# EAGLE design untitled (EAGLE 8.6.0)
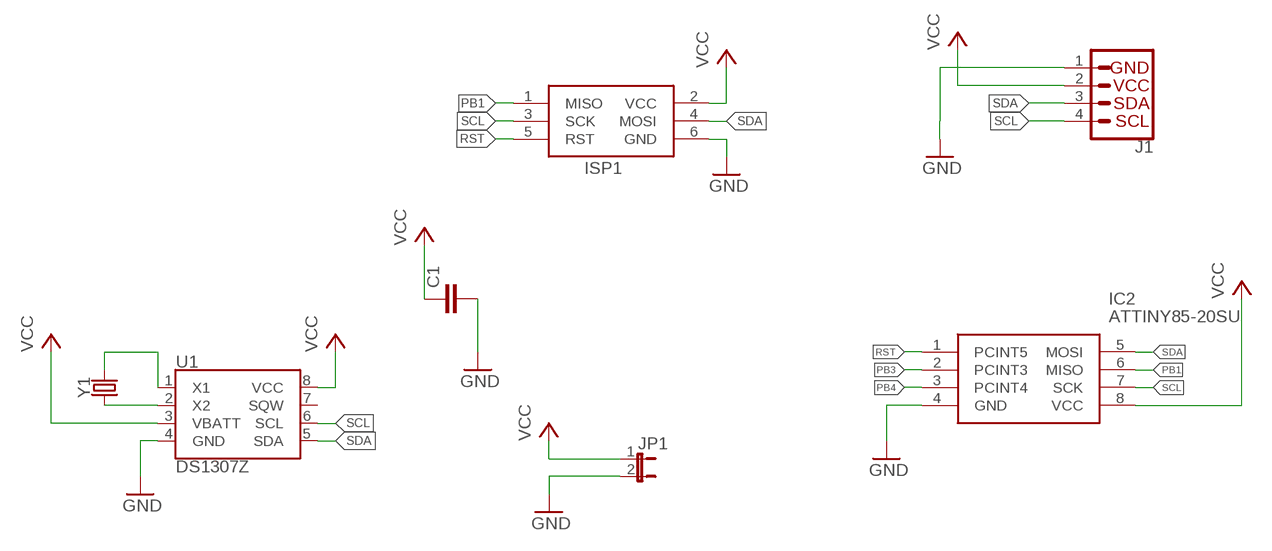
[diagram p0: schematic, sheet 1]

## Parts
C1  C-EUC1206  [C1206]
IC2  ATTINY85-20SU  [SOT127P798X216-8N]
ISP1  AVRISP-6  [AVRISP]
J1  I2C_STANDARD  [1X04]
JP1  JUMPER-2-OLDPTH  [1X02]
U1  DS1307Z  [SO08-0.15]
Y1  CRYSTALPTH-2X6  [CRYSTAL-PTH-2X6-CYL]

## Nets
GND: C1.2 IC2.4(GND) ISP1.6(GND) J1.1 JP1.2 U1.4(GND)
N$1: U1.2(X2) Y1.1
N$3: U1.1(X1) Y1.2
PB1: IC2.6(MISO) ISP1.1(MISO)
PB3: IC2.2(PCINT3)
PB4: IC2.3(PCINT4)
RST: IC2.1(PCINT5) ISP1.5(RST)
SCL: IC2.7(SCK) ISP1.3(SCK) J1.4 U1.6(SCL)
SDA: IC2.5(MOSI) ISP1.4(MOSI) J1.3 U1.5(SDA)
VCC: C1.1 IC2.8(VCC) ISP1.2(VCC) J1.2 JP1.1 U1.3(VBATT) U1.8(VCC)
Unconnected: U1.7(SQW)

## Library data of the parts
C1 = rcl:C-EU: CAPACITOR, European symbol; SPICEPREFIX: C
IC2 = ATTINY85-20SU:ATTINY85-20SU: MICROCHIP - ATTINY85-20SU - MICROCONTROLLER MCU, 8 BIT, ATTINY, 20MHZ, SOIC-8 Source: Datasheet <https://componentsearchengine.com/Datasheets/2/ATTINY85-20SU.pdf>; DESCRIPTION: MICROCHIP - ATTINY85-20SU - MICROCONTROLLER MCU, 8 BIT, ATTINY, 20MHZ, SOIC-8; HEIGHT: 2.16mm; MANUFACTURER_NAME: Microchip; MANUFACTURER_PART_NUMBER: ATTINY85-20SU; MOUSER_PART_NUMBER: 556-ATTINY85-20SU; MOUSER_PRICE-STOCK: https://www.mouser.com/Search/Refine.aspx?Keyword=556-ATTINY85-20SU; RS_PART_NUMBER: 1331674; RS_PRICE-STOCK: http://uk.rs-online.com/web/p/products/1331674
ISP1 = adafruit:AVRISP: AVR ISP HEADER Standard 6 pin header for AVR programming
J1 = SparkFun-Connectors:I2C_STANDARD: SparkFun I2C Standard Pinout Header SparkFun has standardized on a pinout for all I2C based sensor breakouts. This pinout allows I2C boards to be plugged directly into the headers on Arduino Uno compatible boards, and to be daisy chained easily. Example SparkFun Products: SparkFun Atmospheric Sensor Breakout - BME280 <https://www.sparkfun.com/products/13676> SparkFun Altitude/Pressure Sensor Breakout - MPL3115A2 <https://www.sparkfun.com/products/11084> SparkFun TOF Range Finder Sensor - VL6180 <https://www.sparkfun.com/products/12785>
JP1 = SparkFun-Retired:JUMPER-2-OLD: Jumper Basic 0.1" spaced jumper. Use with breakaway headers.
U1 = SparkFun-Clocks:DS1307: Maxim DS1307 - I2C Real-time clock (RTC) The DS1307 serial real-time clock (RTC) is a low-power, full binary-coded decimal (BCD) clock/calendar plus 56 bytes of NV SRAM. Address and data are transferred serially through an I2C, bidirectional bus. The clock/calendar provides seconds, minutes, hours, day, date, month, and year information. SparkFun Products: Real Time Clock Module <https://www.sparkfun.com/products/12708> (BOB-12708) Datasheet <https://cdn.sparkfun.com/datasheets/BreakoutBoards/DS1307.pdf>; PROD_ID: IC-08138
Y1 = SparkFun-Clocks:CRYSTAL: Crystals (Generic) These are passive quartz crystals, which can be used as a clock source for a microcontroller. Crystal's are two-terminal devices. They require external "load" capacitors to generate an oscillating signal.

## Board
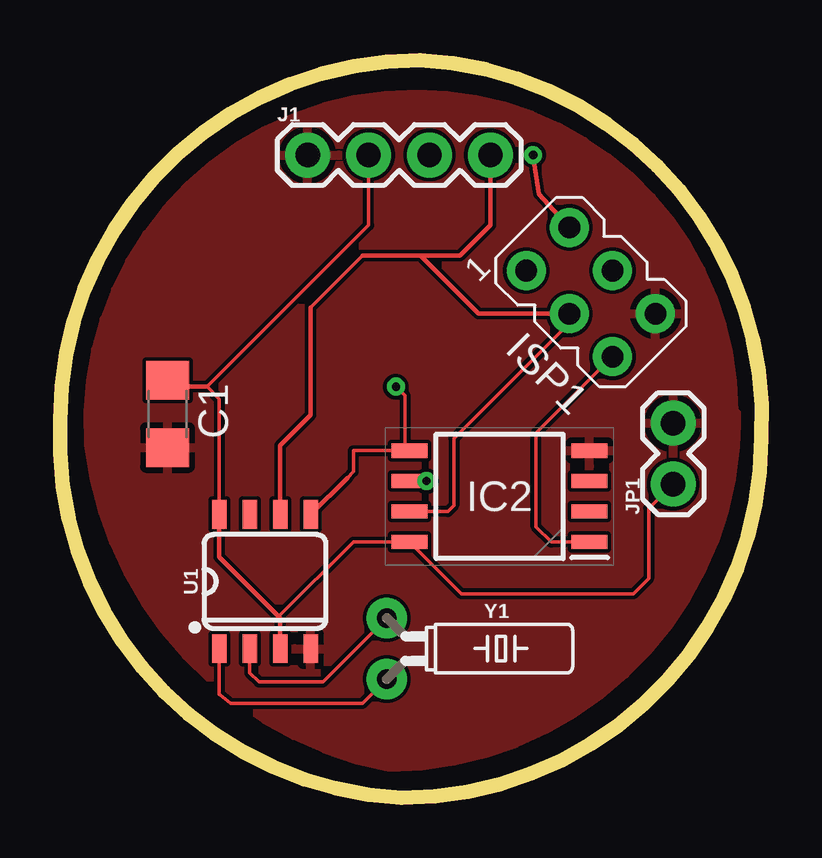
[diagram p1: board, top side]
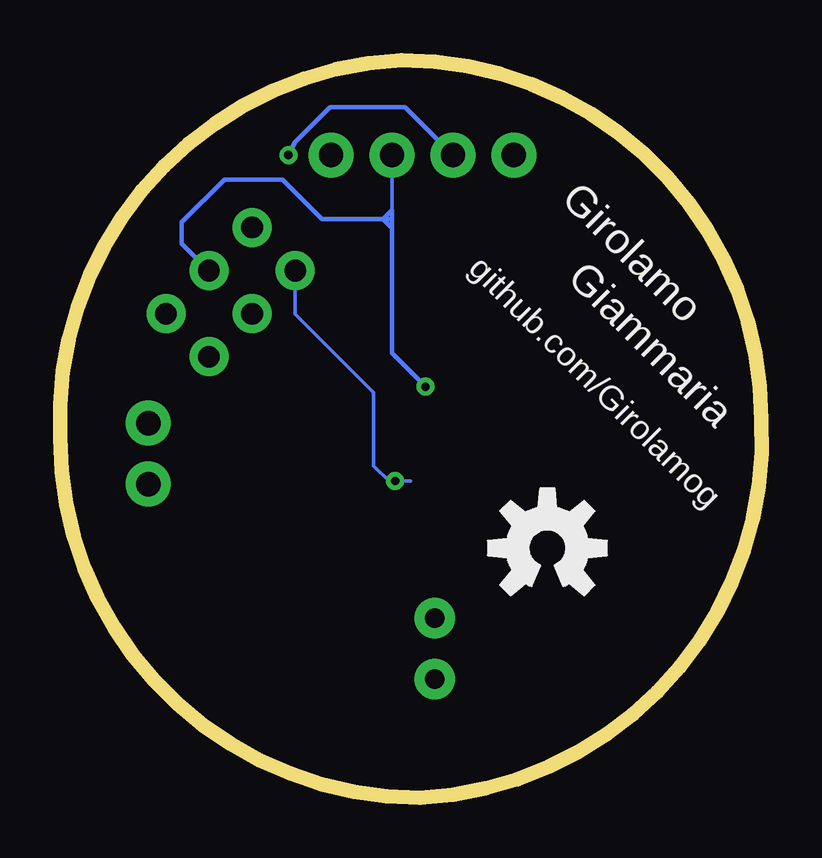
[diagram p2: board, bottom side, seen from below]

Size 29.25 x 30.76 mm. Coordinates in mm from the lower left corner, seen from the top.
Outline: 14.24,0 arc-90 0.01,15.76 arc-90 15.01,30.76 arc-90 29.24,15 arc-90 14.24,0
Copper layers (1*16): Top 0.035mm / dielectric 1.5mm / Bottom 0.035mm
Design rules "default *": minimum track width 6mil, minimum drill 0.2mm, track to track 6mil, track to pad 15mil, pad to pad 6mil, via to via 6mil, smd to smd 6mil, copper to edge 0.2mm, drill to drill 6mil, minimum pad ring 10mil, minimum via ring 8mil, stop-mask expansion 4mil, vias tented up to drill 0mil, thermal gap 10mil

### Footprints (pad centres in the part's own frame; a part is rotated, then mirrored left to right if it is on the bottom)
C1206 = smd 1.6 x 1.8: 1 -1.4,0; 2 1.4,0
SOT127P798X216-8N = smd 1.5 x 0.6: 1 -3.75,1.905; 2 -3.75,0.635; 3 -3.75,-0.635; 4 -3.75,-1.905; 5 3.75,-1.905; 6 3.75,-0.635; 7 3.75,0.635; 8 3.75,1.905
AVRISP = drill 0.9 pad 1.626: 1 -1.27,2.54; 2 1.27,2.54; 3 -1.27,0; 4 1.27,0; 5 -1.27,-2.54; 6 1.27,-2.54
1X04 = drill 1.016 pad 1.88: 1 0,0; 2 2.54,0; 3 5.08,0; 4 7.62,0
1X02 = drill 1.016 pad 1.88: 1 0,0; 2 2.54,0
SO08-0.15 = smd 0.6 x 1.2: 1 -1.905,-2.8; 2 -0.635,-2.8; 3 0.635,-2.8; 4 1.905,-2.8; 5 1.905,2.8; 6 0.635,2.8; 7 -0.635,2.8; 8 -1.905,2.8
CRYSTAL-PTH-2X6-CYL = drill 0.813 pad 1.676: 1 -1.27,0; 2 1.27,0

### Placement (x,y rotation side)
C1  4.48,16 270 top
IC2  18.33,12.57 180 top
ISP1  22.14,21.08 45 top
J1  10.33,26.8 0 top
JP1  25.57,13.08 90 top
U1  8.55,9.02 0 top
U$1  [OSHW-LOGO-M]  8.93,10.41 0 bottom
Y1  13.63,6.22 270 top

### Tracks (layer width: path | path; a pad name or v marks a point on that pad's centre or on a via)
GND
  pour Top: 13.76,1.27 arc90 28.23,16 28.11,16.13 arc90 14.9,29.34 arc94 1.18,14.73 arc73
N$1
  Top 0.152: U1.2 7.91,5.21 8.29,4.83 10.96,4.83 Y1.1
N$3
  Top 0.152: U1.1 6.64,4.32 6.67,4.29 7.12,3.94 12.61,3.94 Y1.2
PB1  (via drill 0.35)
  Top 0.152: IC2.6 v15.28,13.21
  Bottom 0.152: ISP1.1 19.44,20.17 16.17,16.89 16.17,13.84 15.53,13.21 v15.28,13.21 14.64,13.21
RST
  Top 0.152: IC2.1 20.49,10.67 19.85,11.3 19.85,15.2 ISP1.5
SCL
  Top 0.152: ISP1.3 21.24,19.8 16.42,14.99 16.42,12.19 16.17,11.94 IC2.7 | 10.45,20.44 12.62,22.61
  Top 0.178: 12.62,22.61 15.03,22.61 | 15.03,22.61 16.68,22.61 17.95,23.88 J1.4 | 15.03,22.61 17.45,20.18 ISP1.3 | U1.6 9.18,14.68 10.45,15.95 10.45,20.32 10.45,20.44
SDA  (via drill 0.35)
  Top 0.152: 14.39,14.48 12.23,14.48 12.23,13.6 11.98,13.34 | 14.39,14.48 IC2.5 | v14.01,17.14 14.39,16.76 14.39,14.48
  Top 0.178: U1.5 11.98,13.34
  Bottom 0.152: 15.41,24.51 J1.3
  Bottom 0.178: 15.41,23.75 15.41,18.54 v14.01,17.14 | 15.41,23.75 15.41,24.13 | 15.41,24.13 15.41,24.51 15.79,24.13 | ISP1.4 24.17,23.11 24.17,24 22.39,25.78 19.98,25.78 18.33,24.13 15.79,24.13 | 15.79,24.13 15.41,24.13 | 15.79,24.13 15.41,23.75
VCC  (via drill 0.35)
  Top 0.152: U1.8 6.64,16.64 6.14,17.14 12.87,23.88 J1.2 | 9.12,7.56 12.23,10.67 IC2.8 16.74,8.51 23.92,8.51 24.55,9.14 24.55,12.06 JP1.1
  Top 0.178: U1.3 9.18,7.49 9.12,7.56 6.64,10.03 U1.8 | C1.1 4.74,17.14 6.14,17.14 | v19.72,26.8 19.98,25.16 ISP1.2
  Bottom 0.178: J1.2 14.87,28.8 17.98,28.8 19.48,27.3 v19.72,26.8

### Text on the board
bNames: Girolamo | Giammaria | github.com/Girolamog